# Altium schematic sheet fpga_sram.SchDoc
size A
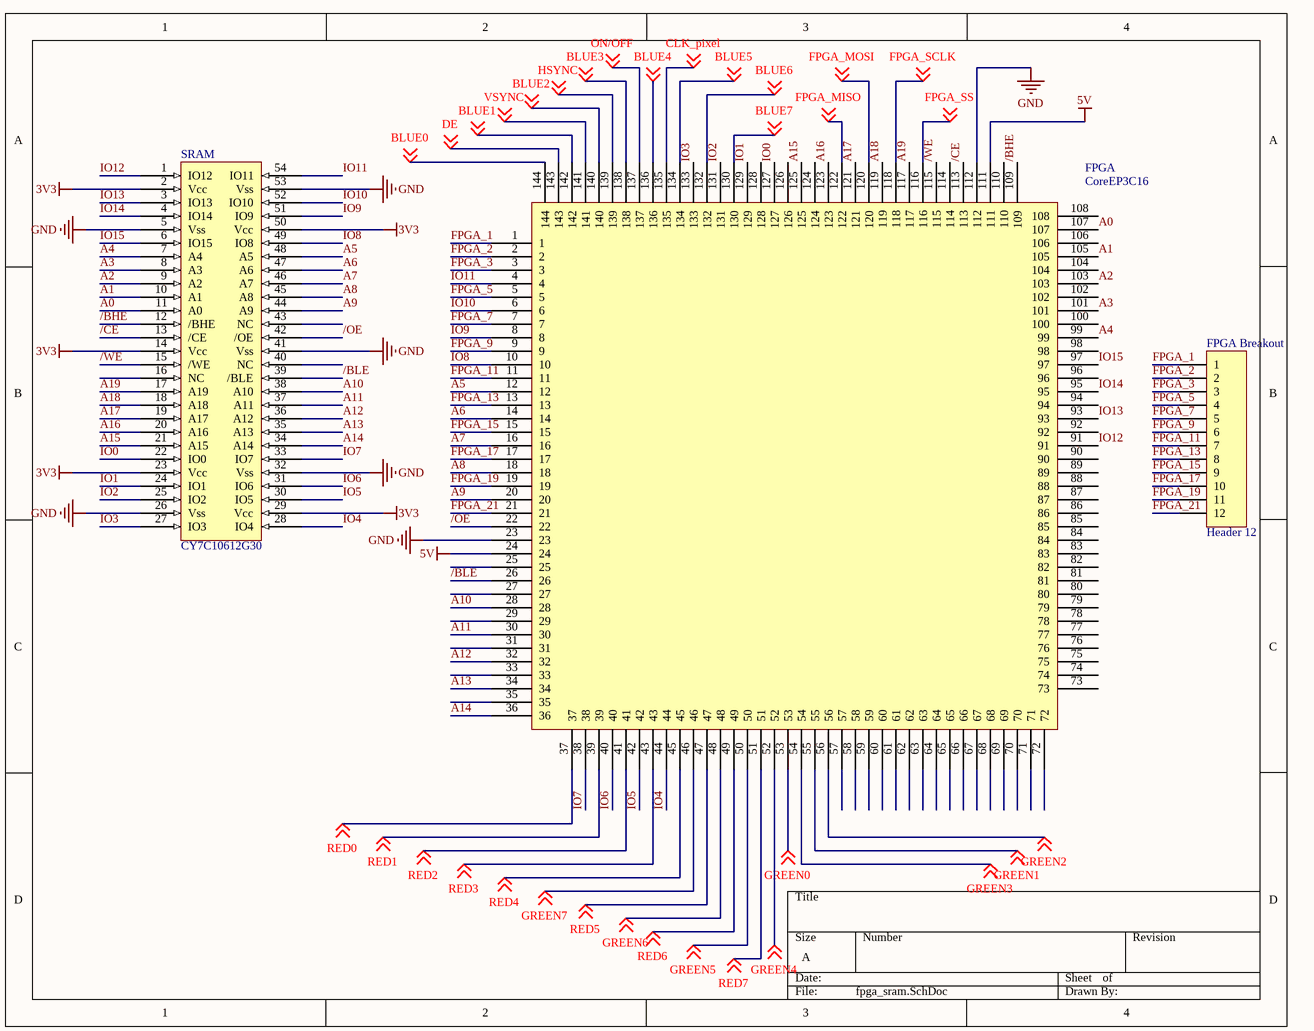
[diagram p0: fpga_sram.SchDoc]

## Parts
FPGA  CoreEP3C16  [CoreEP3C16]
FPGA_Breakout  Header 12  [HDR1X12]
SRAM  CY7C10612G30  [TSOP54]

## Nets
3V3: SRAM.2(Vcc) SRAM.14(Vcc) SRAM.23(Vcc) SRAM.29(Vcc) SRAM.50(Vcc)
5V: FPGA.24 FPGA.111
GND: FPGA.23 FPGA.112 SRAM.5(Vss) SRAM.26(Vss) SRAM.32(Vss) SRAM.41(Vss) SRAM.53(Vss)
/BHE: FPGA.109 SRAM.12(/BHE)
/BLE: FPGA.26 SRAM.39(/BLE)
/CE: FPGA.113 SRAM.13(/CE)
/OE: FPGA.22 SRAM.42(/OE)
/WE: FPGA.115 SRAM.15(/WE)
A0: FPGA.107 SRAM.11(A0)
A1: FPGA.105 SRAM.10(A1)
A2: FPGA.103 SRAM.9(A2)
A3: FPGA.101 SRAM.8(A3)
A4: FPGA.99 SRAM.7(A4)
A5: FPGA.12 SRAM.48(A5)
A6: FPGA.14 SRAM.47(A6)
A7: FPGA.16 SRAM.46(A7)
A8: FPGA.18 SRAM.45(A8)
A9: FPGA.20 SRAM.44(A9)
A10: FPGA.28 SRAM.38(A10)
A11: FPGA.30 SRAM.37(A11)
A12: FPGA.32 SRAM.36(A12)
A13: FPGA.34 SRAM.35(A13)
A14: FPGA.36 SRAM.34(A14)
A15: FPGA.125 SRAM.21(A15)
A16: FPGA.123 SRAM.20(A16)
A17: FPGA.121 SRAM.19(A17)
A18: FPGA.119 SRAM.18(A18)
A19: FPGA.117 SRAM.17(A19)
BLUE0: FPGA.144 ; off-sheet BLUE0
BLUE1: FPGA.142 ; off-sheet BLUE1
BLUE2: FPGA.140 ; off-sheet BLUE2
BLUE3: FPGA.138 ; off-sheet BLUE3
BLUE4: FPGA.136 ; off-sheet BLUE4
BLUE5: FPGA.134 ; off-sheet BLUE5
BLUE6: FPGA.132 ; off-sheet BLUE6
BLUE7: FPGA.130 ; off-sheet BLUE7
CLK_pixel: FPGA.135 ; off-sheet CLK_pixel
DE: FPGA.143 ; off-sheet DE
FPGA_1: FPGA.1 FPGA_Breakout.1
FPGA_2: FPGA.2 FPGA_Breakout.2
FPGA_3: FPGA.3 FPGA_Breakout.3
FPGA_5: FPGA.5 FPGA_Breakout.4
FPGA_7: FPGA.7 FPGA_Breakout.5
FPGA_9: FPGA.9 FPGA_Breakout.6
FPGA_11: FPGA.11 FPGA_Breakout.7
FPGA_13: FPGA.13 FPGA_Breakout.8
FPGA_15: FPGA.15 FPGA_Breakout.9
FPGA_17: FPGA.17 FPGA_Breakout.10
FPGA_19: FPGA.19 FPGA_Breakout.11
FPGA_21: FPGA.21 FPGA_Breakout.12
FPGA_MISO: FPGA.122 ; off-sheet FPGA_MISO
FPGA_MOSI: FPGA.120 ; off-sheet FPGA_MOSI
FPGA_SCLK: FPGA.118 ; off-sheet FPGA_SCLK
FPGA_SS: FPGA.116 ; off-sheet FPGA_SS
GREEN0: FPGA.53 ; off-sheet GREEN0
GREEN1: FPGA.55 ; off-sheet GREEN1
GREEN2: FPGA.56 ; off-sheet GREEN2
GREEN3: FPGA.54 ; off-sheet GREEN3
GREEN4: FPGA.52 ; off-sheet GREEN4
GREEN5: FPGA.50 ; off-sheet GREEN5
GREEN6: FPGA.48 ; off-sheet GREEN6
GREEN7: FPGA.46 ; off-sheet GREEN7
HSYNC: FPGA.139 ; off-sheet HSYNC
IO0: FPGA.127 SRAM.22(IO0)
IO1: FPGA.129 SRAM.24(IO1)
IO2: FPGA.131 SRAM.25(IO2)
IO3: FPGA.133 SRAM.27(IO3)
IO4: FPGA.44 SRAM.28(IO4)
IO5: FPGA.42 SRAM.30(IO5)
IO6: FPGA.40 SRAM.31(IO6)
IO7: FPGA.38 SRAM.33(IO7)
IO8: FPGA.10 SRAM.49(IO8)
IO9: FPGA.8 SRAM.51(IO9)
IO10: FPGA.6 SRAM.52(IO10)
IO11: FPGA.4 SRAM.54(IO11)
IO12: FPGA.91 SRAM.1(IO12)
IO13: FPGA.93 SRAM.3(IO13)
IO14: FPGA.95 SRAM.4(IO14)
IO15: FPGA.97 SRAM.6(IO15)
ON/OFF: FPGA.137 ; off-sheet ON/OFF
RED0: FPGA.37 ; off-sheet RED0
RED1: FPGA.39 ; off-sheet RED1
RED2: FPGA.41 ; off-sheet RED2
RED3: FPGA.43 ; off-sheet RED3
RED4: FPGA.45 ; off-sheet RED4
RED5: FPGA.47 ; off-sheet RED5
RED6: FPGA.49 ; off-sheet RED6
RED7: FPGA.51 ; off-sheet RED7
VSYNC: FPGA.141 ; off-sheet VSYNC

Not connected (* = marked no-connect by the designer): FPGA 25 27 29 31 33 35 57 58 59 60 61 62 63 64 65 66 67 68 69 70 71 72 73 74 75 76 77 78 79 80 81 82 83 84 85 86 87 88 89 90 92 94 96 98 100 102 104 106 108 110 114 124 126 128; SRAM 16(NC) 40(NC) 43(NC)

## Library data of the parts
FPGA_Breakout = Header 12: Header, 12-Pin; LatestRevisionDate: 17-Jul-2002; LatestRevisionNote: Re-released for DXP Platform.; Publisher: Altium Limited